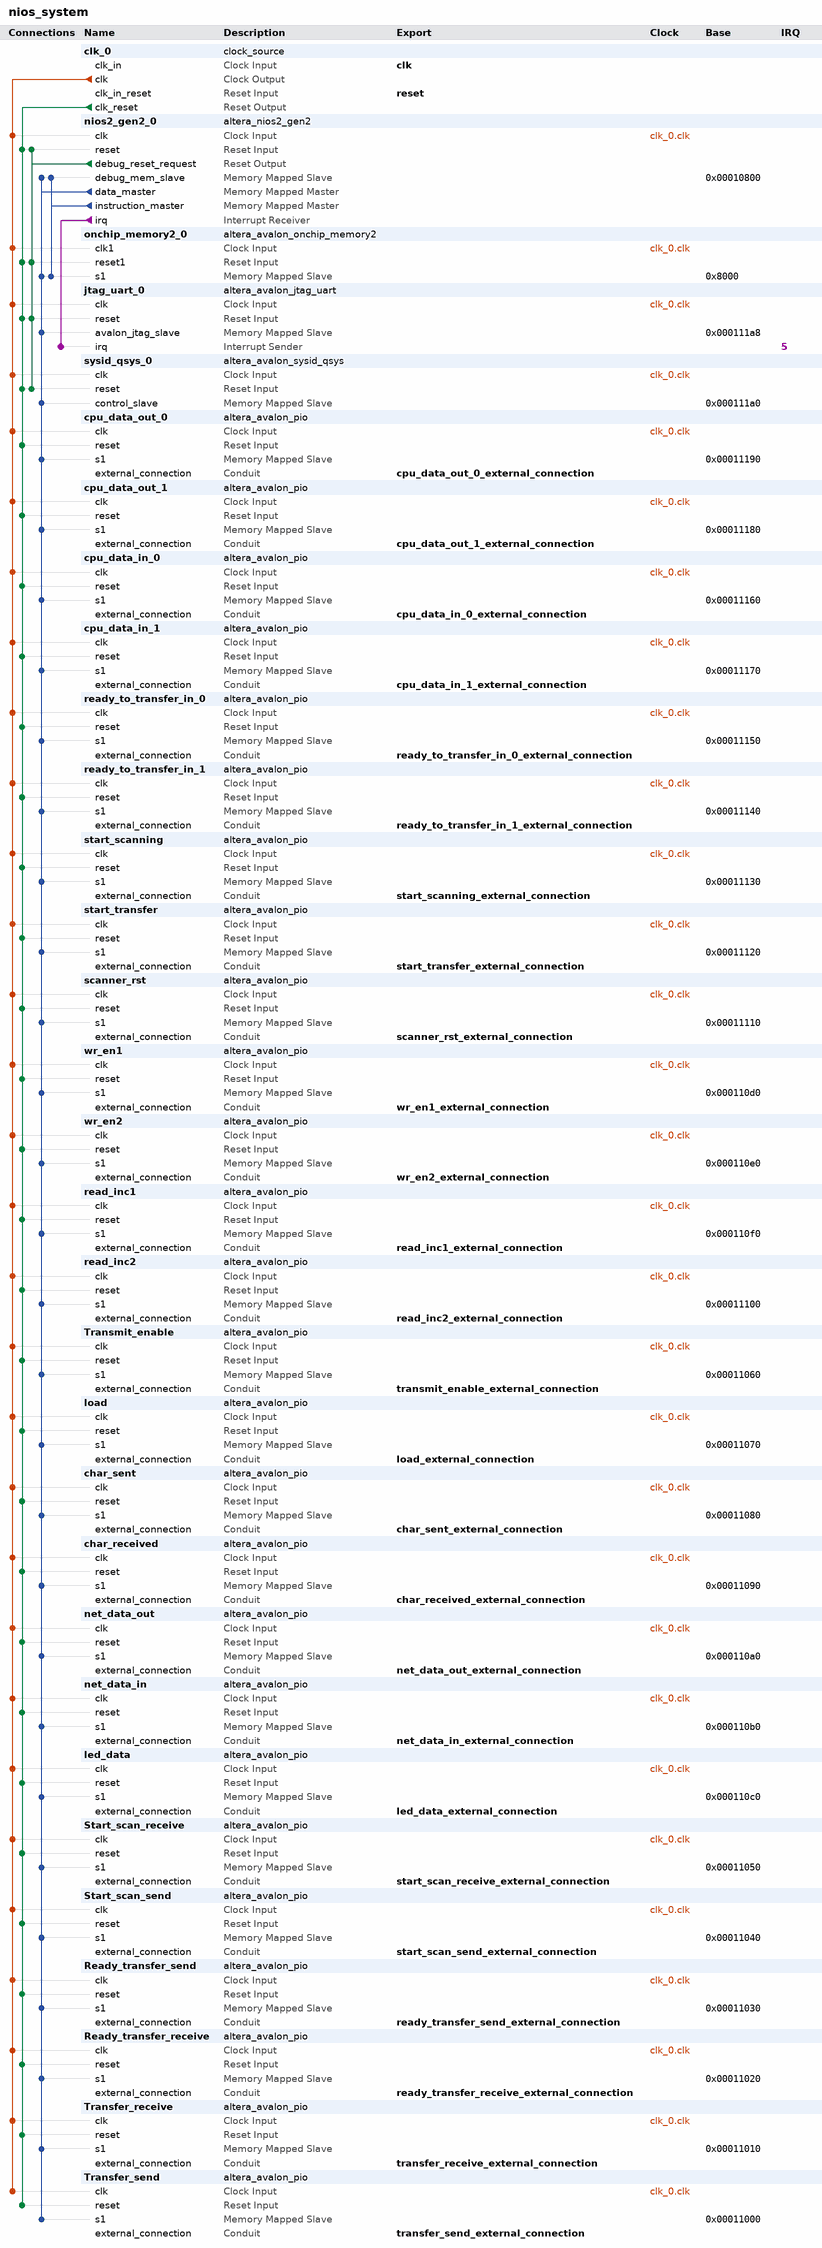
[diagram p0: system contents]
# Platform Designer (Qsys) system nios_system, Cyclone V 5CSEMA5F31C6
# Parameters at their usual value, and those the tool derives, are not listed.
package require -exact qsys 16.0
create_system nios_system
set_project_property DEVICE_FAMILY {Cyclone V}
set_project_property DEVICE 5CSEMA5F31C6

add_instance clk_0 clock_source 16.0
set_instance_parameter_value clk_0 clockFrequency 50000000

add_instance nios2_gen2_0 altera_nios2_gen2 16.0
set_instance_parameter_value nios2_gen2_0 dcache_size 2048
set_instance_parameter_value nios2_gen2_0 exceptionSlave onchip_memory2_0.s1
set_instance_parameter_value nios2_gen2_0 icache_size 4096
set_instance_parameter_value nios2_gen2_0 impl Tiny
set_instance_parameter_value nios2_gen2_0 resetSlave onchip_memory2_0.s1

add_instance onchip_memory2_0 altera_avalon_onchip_memory2 16.0
set_instance_parameter_value onchip_memory2_0 dataWidth 32
set_instance_parameter_value onchip_memory2_0 dualPort false
set_instance_parameter_value onchip_memory2_0 initMemContent true
set_instance_parameter_value onchip_memory2_0 initializationFileName onchip_mem.hex
set_instance_parameter_value onchip_memory2_0 memorySize 20480

add_instance jtag_uart_0 altera_avalon_jtag_uart 16.0
set_instance_parameter_value jtag_uart_0 simInteractiveOptions NO_INTERACTIVE_WINDOWS

add_instance sysid_qsys_0 altera_avalon_sysid_qsys 16.0
set_instance_parameter_value sysid_qsys_0 id 0

add_instance cpu_data_out_0 altera_avalon_pio 16.0
set_instance_parameter_value cpu_data_out_0 direction Output
set_instance_parameter_value cpu_data_out_0 width 8

add_instance cpu_data_out_1 altera_avalon_pio 16.0
set_instance_parameter_value cpu_data_out_1 direction Output
set_instance_parameter_value cpu_data_out_1 width 8

add_instance cpu_data_in_0 altera_avalon_pio 16.0
set_instance_parameter_value cpu_data_in_0 direction Input
set_instance_parameter_value cpu_data_in_0 width 8

add_instance cpu_data_in_1 altera_avalon_pio 16.0
set_instance_parameter_value cpu_data_in_1 direction Input
set_instance_parameter_value cpu_data_in_1 width 8

add_instance ready_to_transfer_in_0 altera_avalon_pio 16.0
set_instance_parameter_value ready_to_transfer_in_0 direction Input
set_instance_parameter_value ready_to_transfer_in_0 width 1

add_instance ready_to_transfer_in_1 altera_avalon_pio 16.0
set_instance_parameter_value ready_to_transfer_in_1 direction Input
set_instance_parameter_value ready_to_transfer_in_1 width 1

add_instance start_scanning altera_avalon_pio 16.0
set_instance_parameter_value start_scanning direction Output
set_instance_parameter_value start_scanning width 8

add_instance start_transfer altera_avalon_pio 16.0
set_instance_parameter_value start_transfer direction Output
set_instance_parameter_value start_transfer width 8

add_instance scanner_rst altera_avalon_pio 16.0
set_instance_parameter_value scanner_rst direction Output
set_instance_parameter_value scanner_rst width 1

add_instance wr_en1 altera_avalon_pio 16.0
set_instance_parameter_value wr_en1 direction Output
set_instance_parameter_value wr_en1 width 1

add_instance wr_en2 altera_avalon_pio 16.0
set_instance_parameter_value wr_en2 direction Output
set_instance_parameter_value wr_en2 width 1

add_instance read_inc1 altera_avalon_pio 16.0
set_instance_parameter_value read_inc1 direction Output
set_instance_parameter_value read_inc1 width 1

add_instance read_inc2 altera_avalon_pio 16.0
set_instance_parameter_value read_inc2 direction Output
set_instance_parameter_value read_inc2 width 1

add_instance Transmit_enable altera_avalon_pio 16.0
set_instance_parameter_value Transmit_enable direction Output
set_instance_parameter_value Transmit_enable width 1

add_instance load altera_avalon_pio 16.0
set_instance_parameter_value load direction Output
set_instance_parameter_value load width 1

add_instance char_sent altera_avalon_pio 16.0
set_instance_parameter_value char_sent direction Input
set_instance_parameter_value char_sent width 1

add_instance char_received altera_avalon_pio 16.0
set_instance_parameter_value char_received direction Input
set_instance_parameter_value char_received width 1

add_instance net_data_out altera_avalon_pio 16.0
set_instance_parameter_value net_data_out direction Output
set_instance_parameter_value net_data_out width 8

add_instance net_data_in altera_avalon_pio 16.0
set_instance_parameter_value net_data_in direction Input
set_instance_parameter_value net_data_in width 8

add_instance led_data altera_avalon_pio 16.0
set_instance_parameter_value led_data direction Output
set_instance_parameter_value led_data width 8

add_instance Start_scan_receive altera_avalon_pio 16.0
set_instance_parameter_value Start_scan_receive direction Input
set_instance_parameter_value Start_scan_receive width 1

add_instance Start_scan_send altera_avalon_pio 16.0
set_instance_parameter_value Start_scan_send direction Output
set_instance_parameter_value Start_scan_send width 1

add_instance Ready_transfer_send altera_avalon_pio 16.0
set_instance_parameter_value Ready_transfer_send direction Output
set_instance_parameter_value Ready_transfer_send width 1

add_instance Ready_transfer_receive altera_avalon_pio 16.0
set_instance_parameter_value Ready_transfer_receive direction Input
set_instance_parameter_value Ready_transfer_receive width 1

add_instance Transfer_receive altera_avalon_pio 16.0
set_instance_parameter_value Transfer_receive direction Input
set_instance_parameter_value Transfer_receive width 1

add_instance Transfer_send altera_avalon_pio 16.0
set_instance_parameter_value Transfer_send direction Output
set_instance_parameter_value Transfer_send width 1

# connections
add_connection clk_0.clk char_received.clk clock
add_connection clk_0.clk char_sent.clk clock
add_connection clk_0.clk cpu_data_in_0.clk clock
add_connection clk_0.clk cpu_data_in_1.clk clock
add_connection clk_0.clk cpu_data_out_0.clk clock
add_connection clk_0.clk cpu_data_out_1.clk clock
add_connection clk_0.clk jtag_uart_0.clk clock
add_connection clk_0.clk led_data.clk clock
add_connection clk_0.clk load.clk clock
add_connection clk_0.clk net_data_in.clk clock
add_connection clk_0.clk net_data_out.clk clock
add_connection clk_0.clk nios2_gen2_0.clk clock
add_connection clk_0.clk onchip_memory2_0.clk1 clock
add_connection clk_0.clk read_inc1.clk clock
add_connection clk_0.clk read_inc2.clk clock
add_connection clk_0.clk ready_to_transfer_in_0.clk clock
add_connection clk_0.clk ready_to_transfer_in_1.clk clock
add_connection clk_0.clk Ready_transfer_receive.clk clock
add_connection clk_0.clk Ready_transfer_send.clk clock
add_connection clk_0.clk scanner_rst.clk clock
add_connection clk_0.clk Start_scan_receive.clk clock
add_connection clk_0.clk Start_scan_send.clk clock
add_connection clk_0.clk start_scanning.clk clock
add_connection clk_0.clk start_transfer.clk clock
add_connection clk_0.clk sysid_qsys_0.clk clock
add_connection clk_0.clk Transfer_receive.clk clock
add_connection clk_0.clk Transfer_send.clk clock
add_connection clk_0.clk Transmit_enable.clk clock
add_connection clk_0.clk wr_en1.clk clock
add_connection clk_0.clk wr_en2.clk clock
add_connection clk_0.clk_reset char_received.reset reset
add_connection clk_0.clk_reset char_sent.reset reset
add_connection clk_0.clk_reset cpu_data_in_0.reset reset
add_connection clk_0.clk_reset cpu_data_in_1.reset reset
add_connection clk_0.clk_reset cpu_data_out_0.reset reset
add_connection clk_0.clk_reset cpu_data_out_1.reset reset
add_connection clk_0.clk_reset jtag_uart_0.reset reset
add_connection clk_0.clk_reset led_data.reset reset
add_connection clk_0.clk_reset load.reset reset
add_connection clk_0.clk_reset net_data_in.reset reset
add_connection clk_0.clk_reset net_data_out.reset reset
add_connection clk_0.clk_reset nios2_gen2_0.reset reset
add_connection clk_0.clk_reset onchip_memory2_0.reset1 reset
add_connection clk_0.clk_reset read_inc1.reset reset
add_connection clk_0.clk_reset read_inc2.reset reset
add_connection clk_0.clk_reset ready_to_transfer_in_0.reset reset
add_connection clk_0.clk_reset ready_to_transfer_in_1.reset reset
add_connection clk_0.clk_reset Ready_transfer_receive.reset reset
add_connection clk_0.clk_reset Ready_transfer_send.reset reset
add_connection clk_0.clk_reset scanner_rst.reset reset
add_connection clk_0.clk_reset Start_scan_receive.reset reset
add_connection clk_0.clk_reset Start_scan_send.reset reset
add_connection clk_0.clk_reset start_scanning.reset reset
add_connection clk_0.clk_reset start_transfer.reset reset
add_connection clk_0.clk_reset sysid_qsys_0.reset reset
add_connection clk_0.clk_reset Transfer_receive.reset reset
add_connection clk_0.clk_reset Transfer_send.reset reset
add_connection clk_0.clk_reset Transmit_enable.reset reset
add_connection clk_0.clk_reset wr_en1.reset reset
add_connection clk_0.clk_reset wr_en2.reset reset
add_connection nios2_gen2_0.debug_reset_request jtag_uart_0.reset reset
add_connection nios2_gen2_0.debug_reset_request nios2_gen2_0.reset reset
add_connection nios2_gen2_0.debug_reset_request onchip_memory2_0.reset1 reset
add_connection nios2_gen2_0.debug_reset_request sysid_qsys_0.reset reset
add_connection nios2_gen2_0.data_master char_received.s1 avalon
set_connection_parameter_value nios2_gen2_0.data_master/char_received.s1 baseAddress 0x00011090
add_connection nios2_gen2_0.data_master char_sent.s1 avalon
set_connection_parameter_value nios2_gen2_0.data_master/char_sent.s1 baseAddress 0x00011080
add_connection nios2_gen2_0.data_master cpu_data_in_0.s1 avalon
set_connection_parameter_value nios2_gen2_0.data_master/cpu_data_in_0.s1 baseAddress 0x00011160
add_connection nios2_gen2_0.data_master cpu_data_in_1.s1 avalon
set_connection_parameter_value nios2_gen2_0.data_master/cpu_data_in_1.s1 baseAddress 0x00011170
add_connection nios2_gen2_0.data_master cpu_data_out_0.s1 avalon
set_connection_parameter_value nios2_gen2_0.data_master/cpu_data_out_0.s1 baseAddress 0x00011190
add_connection nios2_gen2_0.data_master cpu_data_out_1.s1 avalon
set_connection_parameter_value nios2_gen2_0.data_master/cpu_data_out_1.s1 baseAddress 0x00011180
add_connection nios2_gen2_0.data_master jtag_uart_0.avalon_jtag_slave avalon
set_connection_parameter_value nios2_gen2_0.data_master/jtag_uart_0.avalon_jtag_slave baseAddress 0x000111a8
add_connection nios2_gen2_0.data_master led_data.s1 avalon
set_connection_parameter_value nios2_gen2_0.data_master/led_data.s1 baseAddress 0x000110c0
add_connection nios2_gen2_0.data_master load.s1 avalon
set_connection_parameter_value nios2_gen2_0.data_master/load.s1 baseAddress 0x00011070
add_connection nios2_gen2_0.data_master net_data_in.s1 avalon
set_connection_parameter_value nios2_gen2_0.data_master/net_data_in.s1 baseAddress 0x000110b0
add_connection nios2_gen2_0.data_master net_data_out.s1 avalon
set_connection_parameter_value nios2_gen2_0.data_master/net_data_out.s1 baseAddress 0x000110a0
add_connection nios2_gen2_0.data_master nios2_gen2_0.debug_mem_slave avalon
set_connection_parameter_value nios2_gen2_0.data_master/nios2_gen2_0.debug_mem_slave baseAddress 0x00010800
add_connection nios2_gen2_0.data_master onchip_memory2_0.s1 avalon
set_connection_parameter_value nios2_gen2_0.data_master/onchip_memory2_0.s1 baseAddress 0x8000
add_connection nios2_gen2_0.data_master read_inc1.s1 avalon
set_connection_parameter_value nios2_gen2_0.data_master/read_inc1.s1 baseAddress 0x000110f0
add_connection nios2_gen2_0.data_master read_inc2.s1 avalon
set_connection_parameter_value nios2_gen2_0.data_master/read_inc2.s1 baseAddress 0x00011100
add_connection nios2_gen2_0.data_master ready_to_transfer_in_0.s1 avalon
set_connection_parameter_value nios2_gen2_0.data_master/ready_to_transfer_in_0.s1 baseAddress 0x00011150
add_connection nios2_gen2_0.data_master ready_to_transfer_in_1.s1 avalon
set_connection_parameter_value nios2_gen2_0.data_master/ready_to_transfer_in_1.s1 baseAddress 0x00011140
add_connection nios2_gen2_0.data_master Ready_transfer_receive.s1 avalon
set_connection_parameter_value nios2_gen2_0.data_master/Ready_transfer_receive.s1 baseAddress 0x00011020
add_connection nios2_gen2_0.data_master Ready_transfer_send.s1 avalon
set_connection_parameter_value nios2_gen2_0.data_master/Ready_transfer_send.s1 baseAddress 0x00011030
add_connection nios2_gen2_0.data_master scanner_rst.s1 avalon
set_connection_parameter_value nios2_gen2_0.data_master/scanner_rst.s1 baseAddress 0x00011110
add_connection nios2_gen2_0.data_master Start_scan_receive.s1 avalon
set_connection_parameter_value nios2_gen2_0.data_master/Start_scan_receive.s1 baseAddress 0x00011050
add_connection nios2_gen2_0.data_master Start_scan_send.s1 avalon
set_connection_parameter_value nios2_gen2_0.data_master/Start_scan_send.s1 baseAddress 0x00011040
add_connection nios2_gen2_0.data_master start_scanning.s1 avalon
set_connection_parameter_value nios2_gen2_0.data_master/start_scanning.s1 baseAddress 0x00011130
add_connection nios2_gen2_0.data_master start_transfer.s1 avalon
set_connection_parameter_value nios2_gen2_0.data_master/start_transfer.s1 baseAddress 0x00011120
add_connection nios2_gen2_0.data_master sysid_qsys_0.control_slave avalon
set_connection_parameter_value nios2_gen2_0.data_master/sysid_qsys_0.control_slave baseAddress 0x000111a0
add_connection nios2_gen2_0.data_master Transfer_receive.s1 avalon
set_connection_parameter_value nios2_gen2_0.data_master/Transfer_receive.s1 baseAddress 0x00011010
add_connection nios2_gen2_0.data_master Transfer_send.s1 avalon
set_connection_parameter_value nios2_gen2_0.data_master/Transfer_send.s1 baseAddress 0x00011000
add_connection nios2_gen2_0.data_master Transmit_enable.s1 avalon
set_connection_parameter_value nios2_gen2_0.data_master/Transmit_enable.s1 baseAddress 0x00011060
add_connection nios2_gen2_0.data_master wr_en1.s1 avalon
set_connection_parameter_value nios2_gen2_0.data_master/wr_en1.s1 baseAddress 0x000110d0
add_connection nios2_gen2_0.data_master wr_en2.s1 avalon
set_connection_parameter_value nios2_gen2_0.data_master/wr_en2.s1 baseAddress 0x000110e0
add_connection nios2_gen2_0.instruction_master nios2_gen2_0.debug_mem_slave avalon
set_connection_parameter_value nios2_gen2_0.instruction_master/nios2_gen2_0.debug_mem_slave baseAddress 0x00010800
add_connection nios2_gen2_0.instruction_master onchip_memory2_0.s1 avalon
set_connection_parameter_value nios2_gen2_0.instruction_master/onchip_memory2_0.s1 baseAddress 0x8000
add_connection nios2_gen2_0.irq jtag_uart_0.irq interrupt
set_connection_parameter_value nios2_gen2_0.irq/jtag_uart_0.irq irqNumber 5

# exported interfaces
add_interface char_received_external_connection conduit end
set_interface_property char_received_external_connection EXPORT_OF char_received.external_connection
add_interface char_sent_external_connection conduit end
set_interface_property char_sent_external_connection EXPORT_OF char_sent.external_connection
add_interface clk clock sink
set_interface_property clk EXPORT_OF clk_0.clk_in
add_interface cpu_data_in_0_external_connection conduit end
set_interface_property cpu_data_in_0_external_connection EXPORT_OF cpu_data_in_0.external_connection
add_interface cpu_data_in_1_external_connection conduit end
set_interface_property cpu_data_in_1_external_connection EXPORT_OF cpu_data_in_1.external_connection
add_interface cpu_data_out_0_external_connection conduit end
set_interface_property cpu_data_out_0_external_connection EXPORT_OF cpu_data_out_0.external_connection
add_interface cpu_data_out_1_external_connection conduit end
set_interface_property cpu_data_out_1_external_connection EXPORT_OF cpu_data_out_1.external_connection
add_interface led_data_external_connection conduit end
set_interface_property led_data_external_connection EXPORT_OF led_data.external_connection
add_interface load_external_connection conduit end
set_interface_property load_external_connection EXPORT_OF load.external_connection
add_interface net_data_in_external_connection conduit end
set_interface_property net_data_in_external_connection EXPORT_OF net_data_in.external_connection
add_interface net_data_out_external_connection conduit end
set_interface_property net_data_out_external_connection EXPORT_OF net_data_out.external_connection
add_interface read_inc1_external_connection conduit end
set_interface_property read_inc1_external_connection EXPORT_OF read_inc1.external_connection
add_interface read_inc2_external_connection conduit end
set_interface_property read_inc2_external_connection EXPORT_OF read_inc2.external_connection
add_interface ready_to_transfer_in_0_external_connection conduit end
set_interface_property ready_to_transfer_in_0_external_connection EXPORT_OF ready_to_transfer_in_0.external_connection
add_interface ready_to_transfer_in_1_external_connection conduit end
set_interface_property ready_to_transfer_in_1_external_connection EXPORT_OF ready_to_transfer_in_1.external_connection
add_interface ready_transfer_receive_external_connection conduit end
set_interface_property ready_transfer_receive_external_connection EXPORT_OF Ready_transfer_receive.external_connection
add_interface ready_transfer_send_external_connection conduit end
set_interface_property ready_transfer_send_external_connection EXPORT_OF Ready_transfer_send.external_connection
add_interface reset reset sink
set_interface_property reset EXPORT_OF clk_0.clk_in_reset
add_interface scanner_rst_external_connection conduit end
set_interface_property scanner_rst_external_connection EXPORT_OF scanner_rst.external_connection
add_interface start_scan_receive_external_connection conduit end
set_interface_property start_scan_receive_external_connection EXPORT_OF Start_scan_receive.external_connection
add_interface start_scan_send_external_connection conduit end
set_interface_property start_scan_send_external_connection EXPORT_OF Start_scan_send.external_connection
add_interface start_scanning_external_connection conduit end
set_interface_property start_scanning_external_connection EXPORT_OF start_scanning.external_connection
add_interface start_transfer_external_connection conduit end
set_interface_property start_transfer_external_connection EXPORT_OF start_transfer.external_connection
add_interface transfer_receive_external_connection conduit end
set_interface_property transfer_receive_external_connection EXPORT_OF Transfer_receive.external_connection
add_interface transfer_send_external_connection conduit end
set_interface_property transfer_send_external_connection EXPORT_OF Transfer_send.external_connection
add_interface transmit_enable_external_connection conduit end
set_interface_property transmit_enable_external_connection EXPORT_OF Transmit_enable.external_connection
add_interface wr_en1_external_connection conduit end
set_interface_property wr_en1_external_connection EXPORT_OF wr_en1.external_connection
add_interface wr_en2_external_connection conduit end
set_interface_property wr_en2_external_connection EXPORT_OF wr_en2.external_connection

set_interconnect_requirement {$system} qsys_mm.clockCrossingAdapter HANDSHAKE
set_interconnect_requirement {$system} qsys_mm.enableEccProtection FALSE
set_interconnect_requirement {$system} qsys_mm.insertDefaultSlave FALSE
set_interconnect_requirement {$system} qsys_mm.maxAdditionalLatency 1

save_system nios_system.qsys
